# EAGLE design DRV8848 (EAGLE 7.3.0)
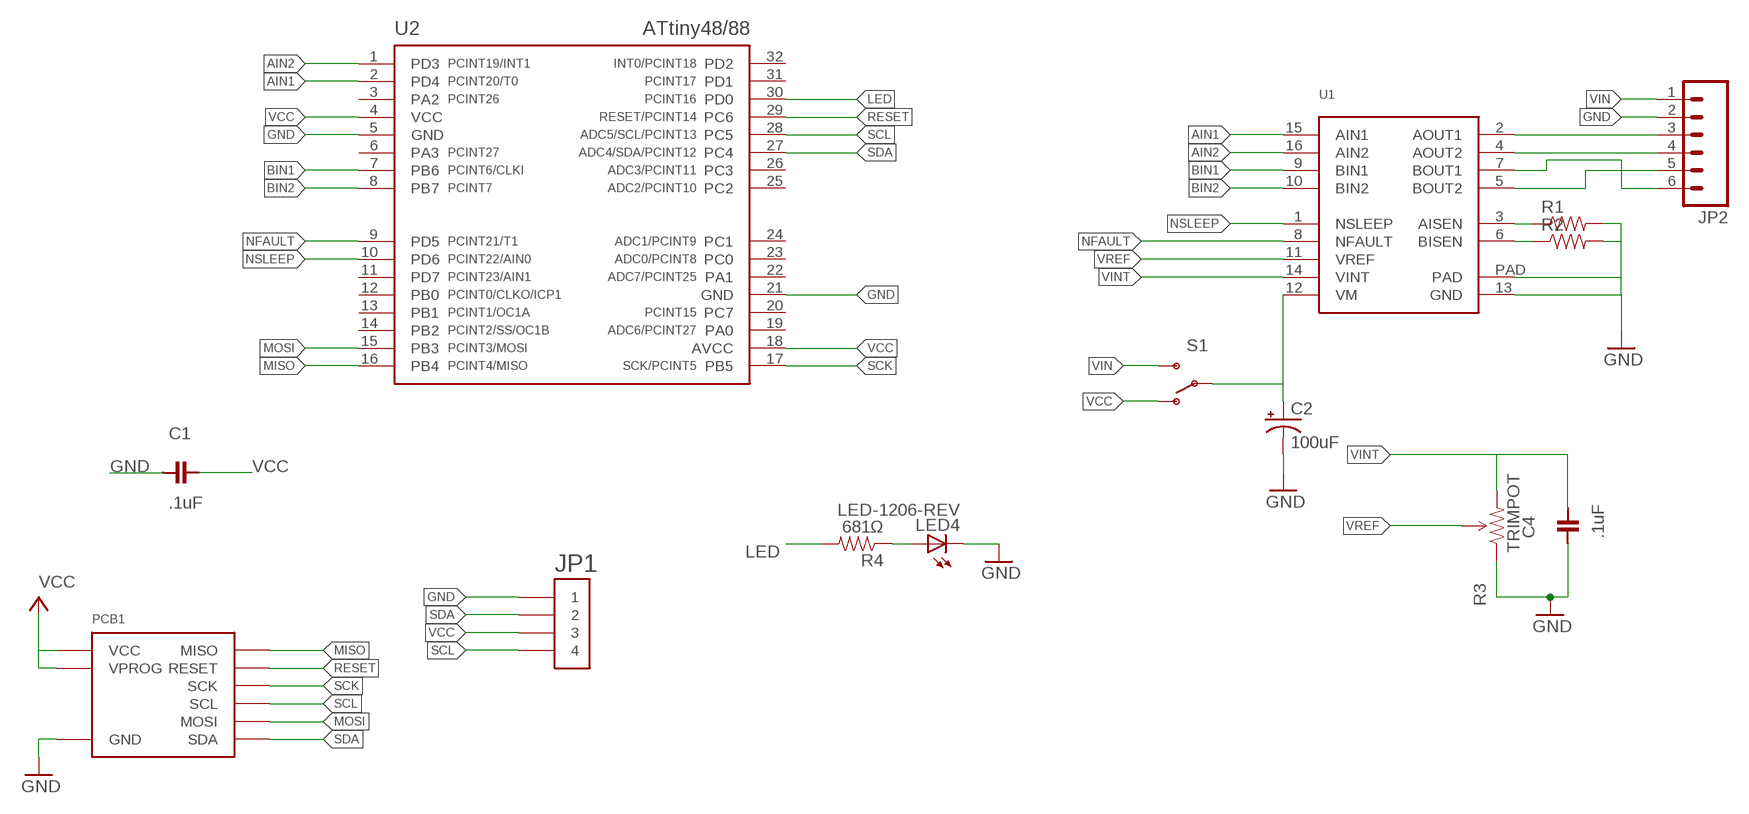
[diagram p0: schematic, sheet 1]

## Parts
C1  .1uF  CAPACITOR-.1UF  [0603]
C2  100uF  CAP_POLD  [PANASONIC_D]
C4  .1uF  CAPACITOR-.1UF  [0603]
JP1  HEADER-1X4-AMPMODU  [AMPMODU-4P]
JP2  M063.5MM-6  [SCREWTERMINAL-3.5MM-6]
LED4  LED-1206-REV  [LED-1206-REV]
PCB1  DEVICE-PCB-TABS  [DEVICE-PCB-TABS]
R1  RESISTOR-0603  [0603]
R2  RESISTOR-0603  [0603]
R3  TRIMPOT  [TRIMPOT-5MM-V2]
R4  681Ω  RESISTOR-681Ω  [0603]
S1  SWITCH-SPDTPTH  [SWITCH-SPDT]
U1  DRV8848  [HTSSOP-16]
U2  ATTINY48/88-TQFP  [TQFP-32]

## Nets
AIN1: U1.15(AIN1) U2.2(PD4)
AIN2: U1.16(AIN2) U2.1(PD3)
BIN1: U1.9(BIN1) U2.7(PB6)
BIN2: U1.10(BIN2) U2.8(PB7)
GND: C1.2 C2.- C4.2 JP1.P$1 JP1.P$2 JP2.2 LED4.C PCB1.GND PCB1.GND1(GND) R1.2 R2.2 R3.A(CCW) U1.13(GND) U1.PAD U2.5(GND) U2.21(GND)
LED: R4.2 U2.30(PD0)
MISO: PCB1.MISO PCB1.MISO1(MISO) U2.16(PB4)
MOSI: PCB1.MOSI PCB1.MOSI1(MOSI) U2.15(PB3)
N$1: JP2.3 U1.2(AOUT1)
N$2: JP2.4 U1.4(AOUT2)
N$3: JP2.5 U1.5(BOUT2)
N$4: JP2.6 U1.7(BOUT1)
N$5: R1.1 U1.3(AISEN)
N$6: R2.1 U1.6(BISEN)
N$7: LED4.A R4.1
N$10: C2.+ S1.2(P) U1.12(VM)
NFAULT: U1.8(NFAULT) U2.9(PD5)
NSLEEP: U1.1(NSLEEP) U2.10(PD6)
RESET: PCB1.RESET PCB1.RESET1(RESET) U2.29(PC6)
SCK: PCB1.CLK1(SCK) PCB1.CLK(SCK) U2.17(PB5)
SCL: JP1.P$7 JP1.P$8 PCB1.SCL PCB1.SCL1(SCL) U2.28(PC5)
SDA: JP1.P$3 JP1.P$4 PCB1.SDA PCB1.SDA1(SDA) U2.27(PC4)
VCC: C1.1 JP1.P$5 JP1.P$6 PCB1.VCC PCB1.VCC1(VCC) PCB1.VPROG PCB1.VPROG1(VPROG) S1.1(O) U2.4(VCC) U2.18(AVCC)
VIN: JP2.1 S1.3(S)
VINT: C4.1 R3.C(CW) U1.14(VINT)
VREF: R3.B(WIPER) U1.11(VREF)
Unconnected: U2.3(PA2) U2.6(PA3) U2.11(PD7) U2.12(PB0) U2.13(PB1) U2.14(PB2) U2.19(PA0) U2.20(PC7) U2.22(PA1) U2.23(PC0) U2.24(PC1) U2.25(PC2) U2.26(PC3) U2.31(PD1) U2.32(PD2)

## Library data of the parts
C1 C4 = Modulo:CAPACITOR: Capacitor; PARTNUM: C0603C104K5RACTU
C2 = IntegerLabs:CAP_POL: Capacitor Polarized These are standard SMD and PTH capacitors. Normally 10uF, 47uF, and 100uF in electrolytic and tantalum varieties. Always verify the external diameter of the through hole cap, it varies with capacity, voltage, and manufacturer. The EIA devices should be standard.
JP1 = Modulo:HEADER-1X4
JP2 = SparkFun-Connectors:M06: Header 6 Standard 6-pin 0.1" header. Use with straight break away headers (SKU : PRT-00116), right angle break away headers (PRT-00553), swiss pins (PRT-00743), machine pins (PRT-00117), and female headers (PRT-00115). Molex polarized connector foot print use with SKU : PRT-08094 with associated crimp pins and housings. NOTES ON THE VARIANTS LOCK and LOCK_LONGPADS... This footprint was designed to help hold the alignment of a through-hole component (i.e. 6-pin header) while soldering it into place. You may notice that each hole has been shifted either up or down by 0.005 of an inch from it's more standard position (which is a perfectly straight line). This slight alteration caused the pins (the squares in the middle) to touch the edges of the holes. Because they are alternating, it causes a "brace" to hold the component in place. 0.005 has proven to be the perfect amount of "off-center" position when using our standard breakaway headers. Although looks a little odd when you look at the bare footprint, once you have a header in there, the alteration is very hard to notice. Also,if you push a header all the way into place, it is covered up entirely on the bottom side. This idea of altering the position of holes to aid alignment will be further integrated into the Sparkfun Library for other footprints. It can help hold any component with 3 or more connection pins.
LED4 = Modulo:LED: LED
PCB1 = Modulo:DEVICE-PCB: Modulo Footprint; NOBOM: 1
R1 R2 = Modulo:RESISTOR: Resistor Basic schematic elements and footprints for 0603, 1206, and PTH resistors.
R3 = SparkFun-Electromechanical:TRIMPOT: Various small potentiometers for "set-and-forget" applications
R4 = Modulo:RESISTOR: Resistor Basic schematic elements and footprints for 0603, 1206, and PTH resistors.; PARTNUM: ERJ-3EKF6810V
S1 = SparkFun-Electromechanical:SWITCH-SPDT: SPDT Switch Simple slide switch, Spark Fun Electronics SKU : COM-00102 DPDT SMT slide switch, AYZ0202, SWCH-08179
U1 = Modulo:DRV8848
U2 = Modulo:ATTINY48/88

## Board
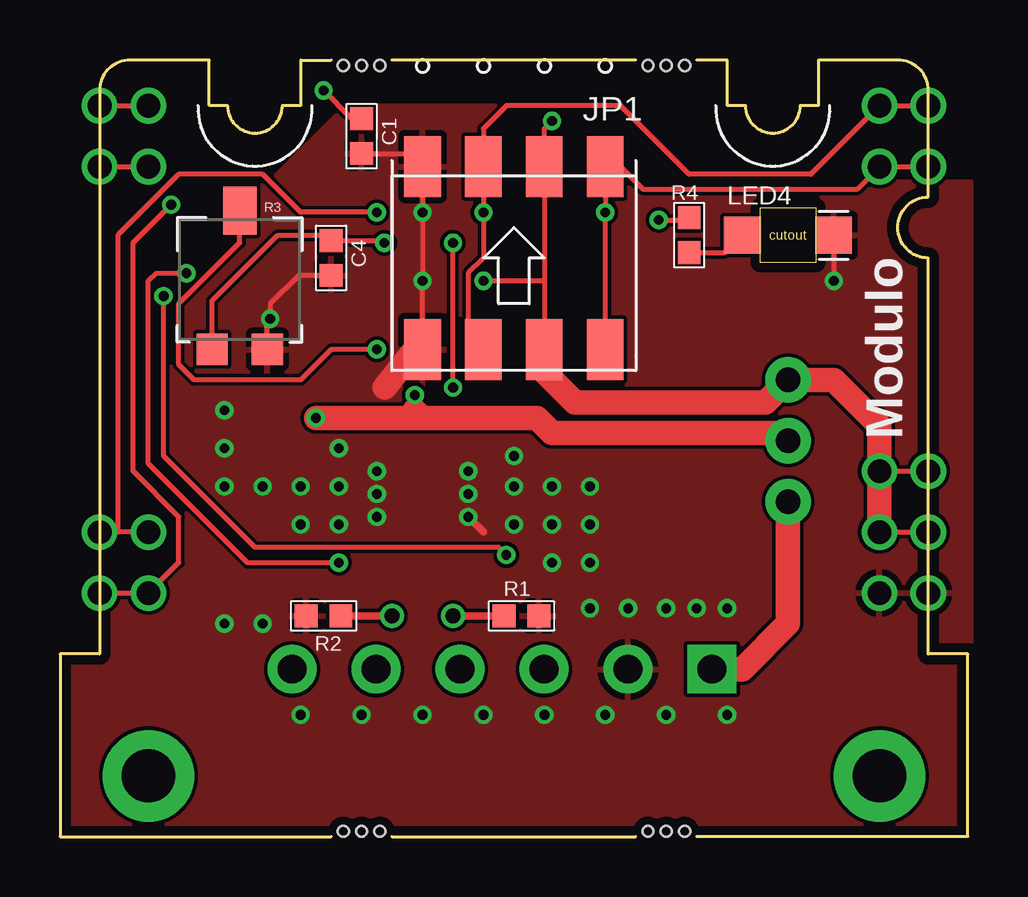
[diagram p1: board, top side]
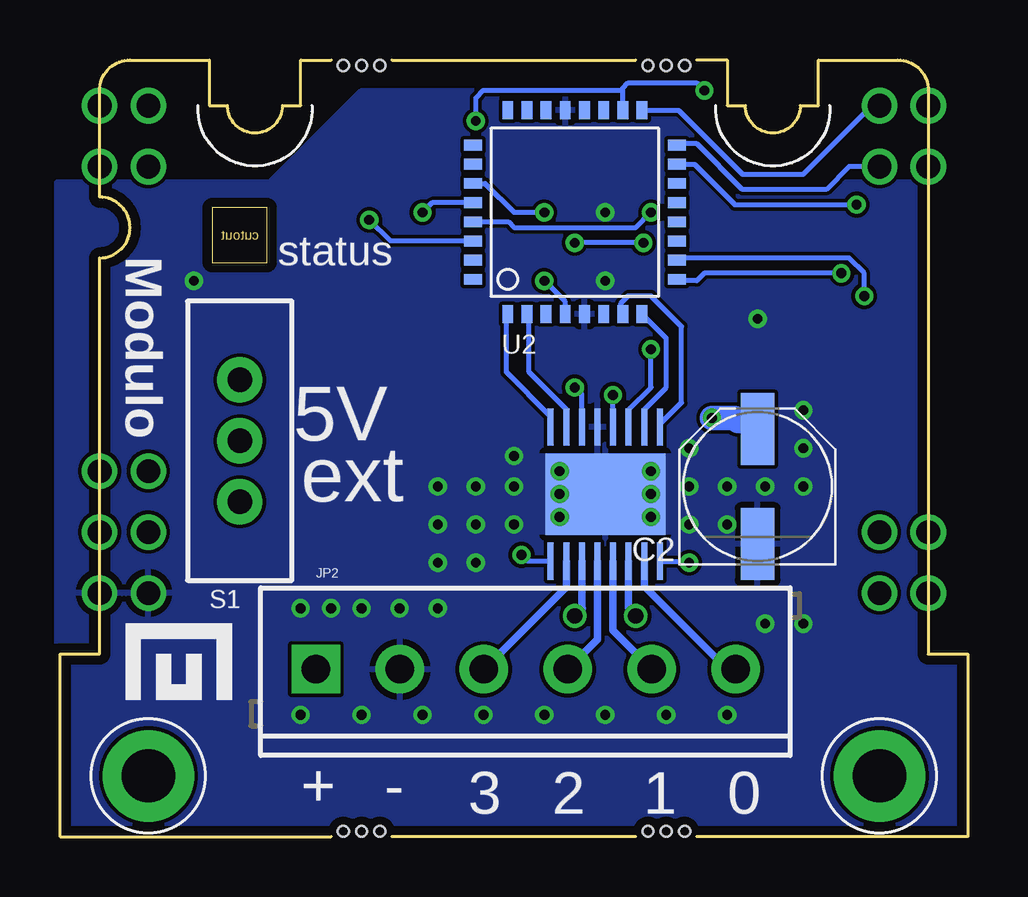
[diagram p2: board, bottom side, seen from below]

Size 37.85 x 32.38 mm. Coordinates in mm from the lower left corner, seen from the top.
Copper layers (1*16): Top 0.0356mm / dielectric 1.5011mm / Bottom 0.0356mm
Design rules "LaenPCBOrder": minimum track width 6mil, minimum drill 13mil, track to track 6mil, track to pad 6mil, pad to pad 6mil, via to via 6mil, smd to smd 6mil, copper to edge 15mil, drill to drill 6mil, minimum pad ring 7mil, minimum via ring 7mil, stop-mask expansion 3mil, vias tented up to drill 0mil, thermal gap 10mil

### Footprints (pad centres in the part's own frame; a part is rotated, then mirrored left to right if it is on the bottom)
0603 = smd 0.95 x 0.95: 1 -0.725,0; 2 0.725,0
PANASONIC_D = smd 3 x 1.4: + 2.4,0; - -2.4,0
AMPMODU-4P = smd 1.524 x 2.54: P$1 -3.81,3.81; P$2 -3.81,-3.81; P$3 -1.27,3.81; P$4 -1.27,-3.81; P$5 1.27,3.81; P$6 1.27,-3.81; P$7 3.81,3.81; P$8 3.81,-3.81
SCREWTERMINAL-3.5MM-6 = drill 1.2 pad 2.032 square: 1 0,0 | drill 1.2 pad 2.032: 2 3.5,0; 3 7,0; 4 10.5,0; 5 14,0; 6 17.5,0
LED-1206-REV = smd 1.524 x 1.524: A -1.905,0; C 1.9,0
DEVICE-PCB-TABS = drill 0.991: CLK -15.24,30.48; CLK1 -17.272,30.48; GND 15.24,10.16; GND1 17.272,10.16; MISO -15.24,27.94; MISO1 -17.272,27.94; MOSI -15.24,10.16; MOSI1 -17.272,10.16; RESET -15.24,12.7; RESET1 -17.272,12.7; SCL 15.24,27.94; SCL1 17.272,27.94; SDA 15.24,30.48; SDA1 17.272,30.48; VCC 15.24,12.7; VCC1 17.272,12.7; VPROG 17.272,15.24; VPROG1 15.24,15.24 | drill 2.223 pad 3.81: P$1 15.24,2.54; P$2 -15.24,2.54 | hole 0.457: -5.588,32.156; -6.35,32.156; -7.112,32.156; 7.112,32.156; 6.35,32.156; 5.588,32.156; -7.112,0.229; -6.35,0.229; -5.588,0.229; 5.588,0.229; 6.35,0.229; 7.112,0.229
TRIMPOT-5MM-V2 = smd 1.3 x 1.3: A 1.15,-2.54; C -1.15,-2.54 | smd 1.402 x 2: B 0,3.239
SWITCH-SPDT = drill 1.016 pad 1.88: 1 0,2.54; 2 0,0; 3 0,-2.54
HTSSOP-16 = smd 0.25 x 1.55: 1 -2.275,-2.8; 2 -1.625,-2.8; 3 -0.975,-2.8; 4 -0.325,-2.8; 5 0.325,-2.8; 6 0.975,-2.8; 7 1.625,-2.8; 8 2.275,-2.8; 9 2.275,2.8; 10 1.625,2.8; 11 0.975,2.8; 12 0.325,2.8; 13 -0.325,2.8; 14 -0.975,2.8; 15 -1.625,2.8; 16 -2.275,2.8 | smd 5 x 3.4: PAD 0,0
TQFP-32 = smd 0.75 x 0.45: 1 -4.25,2.8; 2 -4.25,2; 3 -4.25,1.2; 4 -4.25,0.4; 5 -4.25,-0.4; 6 -4.25,-1.2; 7 -4.25,-2; 8 -4.25,-2.8; 17 4.25,-2.8; 18 4.25,-2; 19 4.25,-1.2; 20 4.25,-0.4; 21 4.25,0.4; 22 4.25,1.2; 23 4.25,2; 24 4.25,2.8 | smd 0.45 x 0.75: 9 -2.8,-4.25; 10 -2,-4.25; 11 -1.2,-4.25; 12 -0.4,-4.25; 13 0.4,-4.25; 14 1.2,-4.25; 15 2,-4.25; 16 2.8,-4.25; 25 2.8,4.25; 26 2,4.25; 27 1.2,4.25; 28 0.4,4.25; 29 -0.4,4.25; 30 -1.2,4.25; 31 -2,4.25; 32 -2.8,4.25

### Placement (x,y rotation side)
C1  12.57,29.21 270 top
C2  8.76,14.61 90 bottom
C4  11.3,24.13 270 top
JP1  18.92,24.13 0 top
JP2  27.18,6.99 0 bottom
LED4  30.35,25.08 0 top
PCB1  18.92,0 0 top
R1  19.24,9.21 0 top
R2  10.99,9.21 180 top
R3  7.49,22.86 0 top
R4  26.23,25.08 90 top
S1  30.35,16.51 0 bottom
U1  15.11,14.29 0 bottom
U2  16.38,26.04 90 bottom
U$1  [LOGO-SMALL]  33.21,6.35 0 bottom

### Tracks (layer width: path | path; a pad name or v marks a point on that pad's centre or on a via)
AIN1
  Bottom 0.203: U1.15 16.74,17.82 18.29,19.37 18.29,21.69 U2.2
AIN2
  Bottom 0.203: U1.16 17.39,17.52 19.24,19.37 19.24,21.73 U2.1
BIN1
  Bottom 0.203: U1.9 12.84,17.2 11.94,18.1 11.94,21.27 13.21,22.54 14.16,22.54 14.48,22.23 14.48,21.88 U2.7
BIN2
  Bottom 0.203: U1.10 13.49,17.82 12.57,18.73 12.57,20.77 U2.8
GND  (via drill 0.41)
  Top 0.203: R3.A 8.64,21.47 v8.76,21.59 8.76,22.23 9.94,23.41 C4.2 | C1.2 14.57,28.48 JP1.P$1 v15.11,26.04 v15.11,23.18 JP1.P$2 | LED4.C 32.25,23.82 v32.26,23.18
  Top 0.305: 17.65,12.7 v17.02,13.34
  Top 1.016: JP1.P$2 14.79,20.32 13.52,18.73
  other vias: 13.21,13.34 6.86,16.19 13.21,15.24 13.21,14.29 17.02,15.24 17.02,14.29 11.62,13.02 11.62,14.61 11.62,16.19 6.86,14.61 10.03,14.61 10.03,13.02 18.92,15.88 18.92,14.61 8.45,14.61 6.86,17.78 18.92,13.02 20.51,13.02 20.51,14.61 22.1,14.61 22.1,13.02 20.51,11.43 22.1,11.43 6.86,8.89 8.45,8.89 22.1,9.53 25.27,9.53 23.69,9.53 10.03,5.08 12.57,5.08 15.11,5.08 17.65,5.08 20.19,5.08 22.73,5.08 25.27,5.08 27.81,5.08 26.54,9.53 27.81,9.53
  pour Bottom: -0.13,0 37.97,0 37.97,27.3 29.08,27.3 25.27,31.11 13.21,31.11 9.4,27.3 -0.13,27.3
  pour Top: -0.13,0 -0.13,27.3 8.76,27.3 11.94,30.48 25.91,30.48 29.08,27.3 37.97,27.3 37.97,0
  pour Bottom (no thermals): 11.94,15.88 18.29,15.88 18.29,12.7 11.94,12.7
LED  (via drill 0.41)
  Top 0.203: v24.95,25.72 26.13,25.72 R4.2
  Bottom 0.203: U2.30 24.07,24.84 v24.95,25.72
MISO
  Top 0.203: PCB1.MISO1 PCB1.MISO
  Bottom 0.203: PCB1.MISO 4.95,27.94 5.9,26.99 9.4,26.99 11.3,28.89 12.08,28.89 U2.16
MOSI  (via drill 0.41)
  Top 0.203: PCB1.MOSI1 PCB1.MOSI 4.95,11.43 4.95,13.34 3.05,15.24 3.05,24.77 v4.64,26.35
  Bottom 0.203: U2.15 11.4,28.04 9.71,26.35 v4.64,26.35
N$1
  Bottom 0.305: U1.2 16.74,10.43 JP2.3
N$2
  Bottom 0.305: U1.4 15.44,8.22 JP2.4
N$3
  Bottom 0.305: U1.5 14.79,8.6 JP2.5
N$4
  Bottom 0.305: U1.7 13.49,10.44 10.35,7.3 10,7.3 JP2.6
N$5  (via drill 0.64)
  Top 0.305: v16.38,9.21 R1.1
  Bottom 0.305: U1.3 16.09,9.55 16.06,9.53 v16.38,9.21
N$6  (via drill 0.64)
  Top 0.305: v13.84,9.21 R2.1
  Bottom 0.305: U1.6 14.14,9.55 v13.84,9.21
N$7
  Top 0.203: R4.1 27.72,24.36 LED4.A
N$10  (via drill 0.41)
  Top 0.508: 14.79,17.78 v14.79,18.41
  Top 1.016: 15.1,17.46 14.79,17.78 | 15.1,17.46 19.88,17.46 20.51,16.83 30.04,16.83 S1.2 | v10.67,17.46 15.1,17.46
  Bottom 0.203: U1.12 14.79,18.11 v14.79,18.41
  Bottom 1.016: C2.+ 8.94,17.32 9.58,17.32 9.71,17.46 v10.67,17.46
NFAULT  (via drill 0.41)
  Top 0.203: v11.62,11.43 7.81,11.43 3.68,15.56 3.68,23.18 4,23.5 v5.27,23.5
  Bottom 0.203: 11.94,23.18 U2.9 12.08,23.18 11.3,23.18 10.99,23.5 v5.27,23.5 | U1.8 11.68,11.49 v11.62,11.43
NSLEEP  (via drill 0.41)
  Top 0.203: v18.61,11.75 18.29,12.06 8.13,12.06 4.32,15.88 v4.32,22.54
  Bottom 0.203: U1.1 18.35,11.49 v18.61,11.75 | v4.32,22.54 4.32,23.5 4.95,24.13 12.04,24.13 U2.10
RESET  (via drill 0.41)
  Top 0.203: v13.21,26.04 10.03,26.04 8.44,27.62 4.95,27.62 2.41,25.08 2.41,12.7 | PCB1.RESET 2.41,12.7 | 2.41,12.7 PCB1.RESET1
  Bottom 0.203: U2.29 19.16,25.64 18.92,25.4 13.84,25.4 v13.21,26.04
SCK
  Top 0.203: PCB1.CLK1 PCB1.CLK
  Bottom 0.203: U2.17 12.06,30.29 9.4,27.62 6.86,27.62 4,30.48 PCB1.CLK
SCL  (via drill 0.41)
  Top 0.203: PCB1.SCL1 PCB1.SCL 33.21,26.99 24.32,26.99 22.73,28.57 | 22.73,28.89 22.73,28.57 | 22.73,28.57 JP1.P$7 v22.73,26.04 JP1.P$8
  Bottom 0.203: U2.28 22.33,26.43 v22.73,26.04
SDA  (via drill 0.41)
  Top 0.203: PCB1.SDA1 PCB1.SDA 31.31,27.62 26.22,27.62 23.37,30.48 18.61,30.48 17.65,29.53 JP1.P$3 v17.65,26.04 17.65,24.13 17.02,23.5 17.02,20.95 JP1.P$4
  Bottom 0.203: U2.27 20.12,27.23 18.92,26.04 v17.65,26.04
VCC  (via drill 0.41)
  Top 0.203: C1.1 12.17,29.93 v10.99,31.11 | PCB1.VPROG1 PCB1.VPROG | PCB1.VCC PCB1.VCC1 | v17.65,23.18 20.19,23.18 | 20.19,23.18 JP1.P$6 | 20.19,23.18 JP1.P$5 20.19,29.53 v20.51,29.84
  Top 1.016: JP1.P$6 20.19,19.37 21.46,18.1 29.4,18.1 S1.1 32.26,19.05 34.16,17.14 PCB1.VPROG1 PCB1.VCC
  Bottom 0.203: U2.18 14.38,31.21 | 14.38,31.21 14.16,31.43 11.3,31.43 v10.99,31.11 | U2.4 16.78,22.31 v17.65,23.18 | v20.51,29.84 20.51,30.8 20.19,31.11 14.48,31.11 14.38,31.21
VIN
  Top 1.016: JP2.1 28.45,6.99 30.35,8.89 S1.3
VINT  (via drill 0.41)
  Top 0.203: v16.38,18.73 v16.38,24.77 | R3.C 6.34,22.34 9.08,25.08 11.08,25.08 C4.1 13.43,24.86 v13.52,24.77
  Bottom 0.203: U1.14 16.09,18.44 v16.38,18.73 | v13.52,24.77 v16.38,24.77
VREF  (via drill 0.41)
  Top 0.203: v13.21,20.32 11.3,20.32 10.03,19.05 5.59,19.05 4.95,19.68 4.95,22.23 7.49,24.77 7.49,25.4 7.43,25.46 7.43,26.04 R3.B
  Bottom 0.203: U1.11 14.14,17.8 13.21,18.73 v13.21,20.32

### Text on the board
bPlace: status | 5V | ext | 0 | 1 | 2 | 3 | - | +